# Altium schematic sheet PowerSwitch.SchDoc: POWER BLOCK
size A4; SheetNumber: 5; SheetTotal: 7; DOC_NO_SCH_DWG: #022024031504
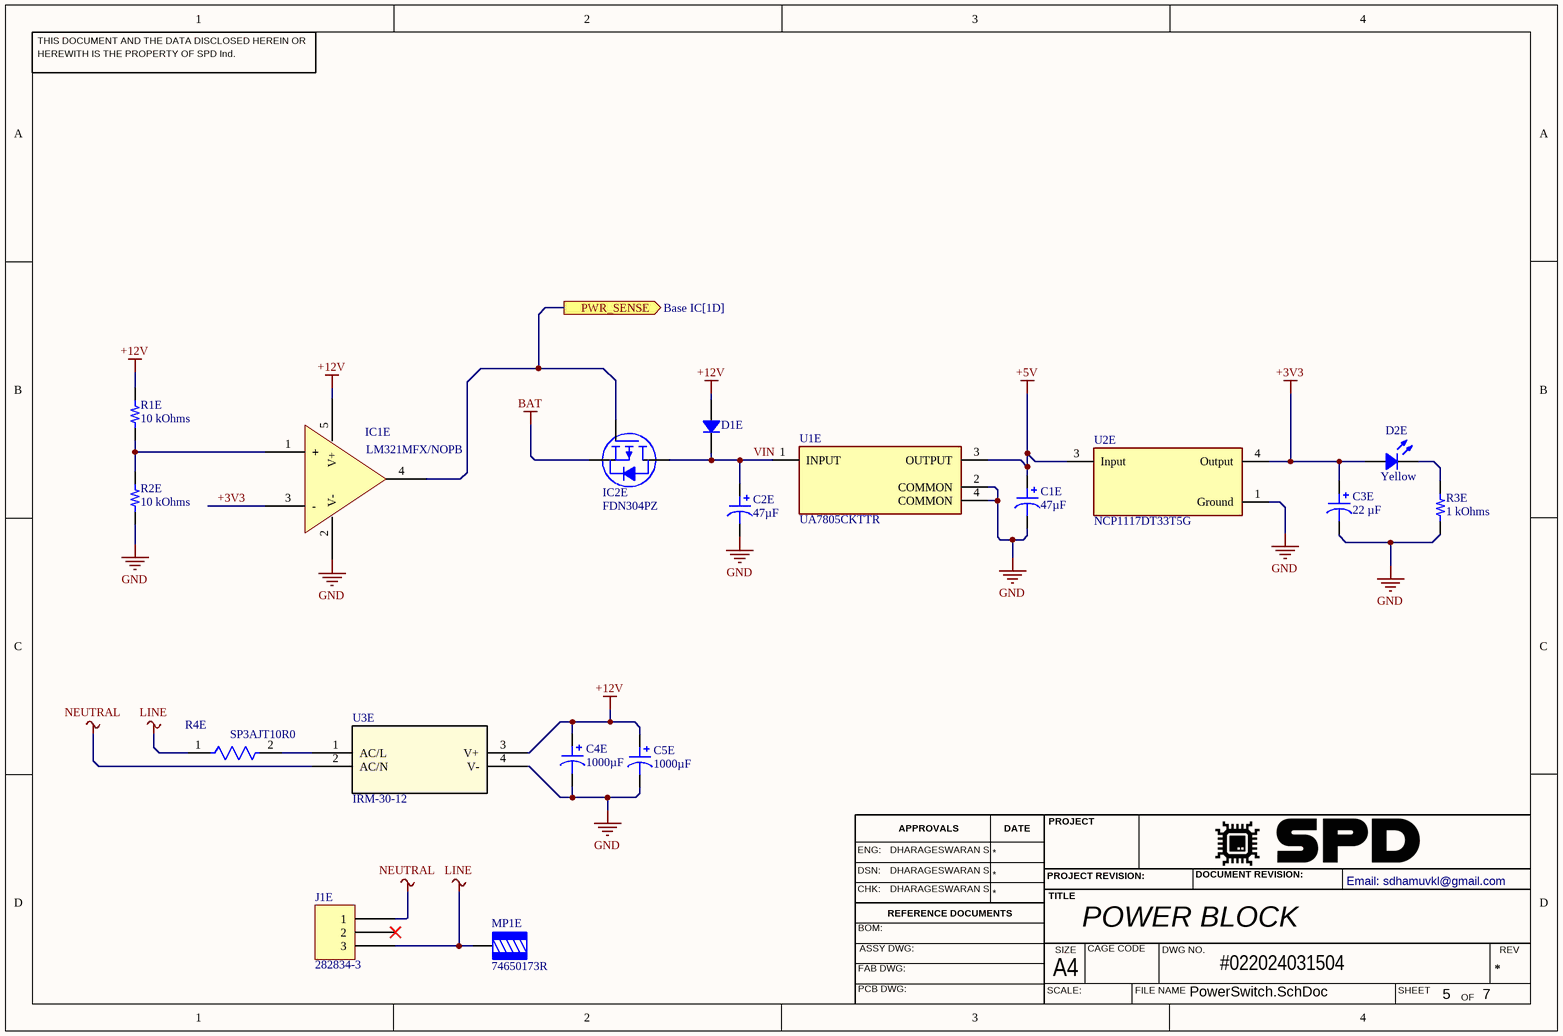
[diagram p0: PowerSwitch.SchDoc]

## Parts
C1E  47µF  [CAP ALSMD 6.6MM H5.4MM]
C2E  47µF  [CAP ALSMD 6.6MM H5.4MM]
C3E  22 µF  [CAP POL 2917_7343]
C4E  1000µF  [CAP TH ALUM ELEC D10.00mm S5.00mm H14.00mm]
C5E  1000µF  [CAP TH ALUM ELEC D10.00mm S5.00mm H14.00mm]
D1E  ES2A-13-F  [DO214AA SMB]  (value not drawn)
D2E  Yellow  [LED 0402_1005 YELLOW]
IC1E  LM321MFX/NOPB  [TI SOT-23-5 DBV]
IC2E  FDN304PZ  [ON SEMI SOT-23-3]
J1E  282834-3  [TE 282834-3]
MP1E  74650173R  [WURTH 74650173]
R1E  10 kOhms  [RES 0402_1005]
R2E  10 kOhms  [RES 0402_1005]
R3E  1 kOhms  [RES 0402_1005]
R4E  SP3AJT10R0  [FP-SP3A-MFG]
U1E  UA7805CKTTR  [FP-KTT0003A-MFG]
U2E  NCP1117DT33T5G  [FP-369C-MFG]
U3E  IRM-30-12  [IRM-30_MWU]

## Ports
PWR_SENSE (out, see Base IC[1D])

## Nets
+3V3: C3E.1 D2E.1 IC1E.3(-) U2E.4(Output)
+5V: C1E.1 U1E.3(OUTPUT) U2E.3(Input)
+12V: C4E.1 C5E.1 D1E.1 IC1E.5(V+) R1E.2 U3E.3(V+)
BAT: IC2E.2(S)
GND: C1E.2 C2E.2 C3E.2 C4E.2 C5E.2 IC1E.2(V-) R2E.1 R3E.1 U1E.2(COMMON) U1E.4(COMMON) U2E.1(Ground) U3E.4(V-)
LINE: J1E.3 MP1E.1 R4E.1
NEUTRAL: J1E.1 U3E.2(AC/N)
PWR_SENSE: IC1E.4(OUT) IC2E.1(G) ; port PWR_SENSE
VIN: C2E.1 D1E.2 IC2E.3(D) U1E.1(INPUT)
NetD2E_2: D2E.2 R3E.2
NetIC1E_1: IC1E.1(+) R1E.1 R2E.2
NetR4E_2: R4E.2 U3E.1(AC/L)

Not connected (* = marked no-connect by the designer): J1E 2*

## Notes on the sheet
- THIS DOCUMENT AND THE DATA DISCLOSED HEREIN OR
- HEREWITH IS THE PROPERTY OF SPD Ind.
- ENG:
- DHARAGESWARAN S
- APPROVALS
- DATE
- PROJECT
- DSN:
- CHK:
- REFERENCE DOCUMENTS
- PROJECT REVISION:
- TITLE
- DOCUMENT REVISION:
- Email: sdhamuvkl@gmail.com <https://github.com/DhamuVkl>
- BOM:
- FAB DWG:
- PCB DWG:
- ASSY DWG:
- SCALE:
- A4
- SIZE
- CAGE CODE
- FILE NAME
- DWG NO.
- SHEET
- REV
- OF

## Library data of the parts
C1E C2E = EEE-HA1C470P: CAP ALUM 47UF 20% 16V SMD; Manufacturer: Panasonic Electronic Components; id: 1065; Ripple Current @ Low Frequency: 70mA @ 120Hz; Surface Mount Land Size: 0.260" L x 0.260" W (6.60mm x 6.60mm); Polarization: Polar; Lifetime @ Temp.: 1000 Hrs @ 105°C; Ripple Current @ High Frequency: 119mA @ 10kHz; Part Number: EEE-HA1C470P; Value: 47µF; Height - Seated (Max): 0.213" (5.40mm); Supplier Part Number 1: PCE4189CT-ND; ComponentLink2Description: DigiKey Link; ComponentLink1URL: https://industrial.panasonic.com/cdbs/www-data/pdf/RDE0000/ABA0000C1151.pdf; PartId: 8737; Tolerance: ±20%; Supplier 1: DigiKey; Series: HA; LastUpdated: 2020-09-02T01:18:32.593; Part Status: Active; Capacitance: 47µF; Device Package: Radial, Can - SMD; Ratings: AEC-Q200; Voltage - Rated: 16V; Minimum Order: 1; Packaging: TapeAndReel; Applications: Automotive; Package / Case: Radial, Can - SMD; ComponentLink1Description: Datasheet; Price: 0.08; ComponentLink2URL: http://digikey.com/product-detail/en/panasonic-electronic-components/EEE-HA1C470P/PCE4189CT-ND/814262; Lifecycle Status: Active; Operating Temperature: -40°C ~ 105°C; Size / Dimension: 0.248" Dia (6.30mm); Mounting Type: Surface Mount
C3E = T491D226K010AT: CAP TANT 22UF 10% 10V 2917; Manufacturer: KEMET; Manufacturer Size Code: D; id: 3007; Type: Molded; Lifetime @ Temp.: 2000 Hrs @ 125°C; Esr (Equivalent Series Resistance): 1.6Ohm; Part Number: T491D226K010AT; Value: 22 µF; Height - Seated (Max): 0.122" (3.10mm); Supplier Part Number 1: 399-5599-1-ND; ComponentLink2Description: DigiKey Link; Features: General Purpose; ComponentLink1URL: https://api.kemet.com/component-edge/download/datasheet/T491D226K010AT.pdf; PartId: 3007; Tolerance: ±10%; Supplier 1: DigiKey; Series: T491; LastUpdated: 2023-01-02T20:46:27.020; Part Status: Active; Capacitance: 22 µF; Device Package: 2917 (7343 Metric); Voltage - Rated: 10 V; Minimum Order: 1; Packaging: TapeAndReel; Package / Case: 2917 (7343 Metric); ComponentLink1Description: Datasheet; Price: 0.31; ComponentLink2URL: https://www.digikey.com/en/products/detail/kemet/T491D226K010AT/2039625; Lifecycle Status: Active; Operating Temperature: -55°C ~ 125°C; Size / Dimension: 0.287" L x 0.169" W (7.30mm x 4.30mm); Mounting Type: Surface Mount
C4E C5E = 860020375017: CAP ALUM 1000UF 20% 16V RADIAL; Manufacturer: Würth Elektronik; id: 1938; Ripple Current @ Low Frequency: 540mA @ 120Hz; Polarization: Polar; Lifetime @ Temp.: 2000 Hrs @ 105°C; Ripple Current @ High Frequency: 745.2mA @ 100kHz; Part Number: 860020375017; Value: 1000µF; Height - Seated (Max): 0.551" (14.00mm); Supplier Part Number 1: 732-8804-1-ND; ComponentLink2Description: DigiKey Link; ComponentLink1URL: https://katalog.we-online.de/pbs/datasheet/860020375017.pdf; PartId: 11161; Tolerance: ±20%; Supplier 1: DigiKey; Series: WCAP-ATG5; LastUpdated: 2020-09-02T01:31:11.520; Part Status: Active; Capacitance: 1000µF; Device Package: Radial, Can; Voltage - Rated: 16V; Lead Spacing: 0.197" (5.00mm); Minimum Order: 1; Packaging: TapeAndBox; Applications: General Purpose; Package / Case: Radial, Can; ComponentLink1Description: Datasheet; Price: 0.24; ComponentLink2URL: http://digikey.com/product-detail/en/w-rth-elektronik/860020375017/732-8804-1-ND/5728749; Lifecycle Status: Active; Operating Temperature: -40°C ~ 105°C; Size / Dimension: 0.394" Dia (10.00mm); Mounting Type: Through Hole
D1E = ES2A-13-F: DIODE GEN PURP 50V 2A SMB; Manufacturer: Diodes Incorporated; id: 319; Reverse Recovery Time (Trr): 25 ns; Capacitance @ Vr, F: 25pF @ 4V, 1MHz; Speed: Fast Recovery =< 500ns, > 200mA (Io); Voltage - Forward (Vf) (Max) @ If: 920 mV @ 2 A; Diode Type: Standard; Current - Reverse Leakage @ Vr: 5 µA @ 50 V; Part Number: ES2A-13-F; Supplier Part Number 1: ES2A-FDICT-ND; Supplier Device Package: SMB; ComponentLink1Description: Datasheet; ComponentLink2URL: https://www.digikey.com/en/products/detail/diodes-incorporated/ES2A-13-F/815105; ComponentLink1URL: https://www.diodes.com/assets/Datasheets/ds14002.pdf; Supplier 1: DigiKey; Series: -; Part Status: Active; ComponentLink2Description: DigiKey Link; Current - Average Rectified (Io): 2A; Operating Temperature - Junction: -55°C ~ 150°C; Packaging: TapeAndReel; Minimum Order: 1; Voltage - DC Reverse (Vr) (Max): 50 V; Package / Case: DO-214AA, SMB; PartId: 319; Lifecycle Status: Active; LastUpdated: 2023-01-02T20:53:06.797; Mounting Type: Surface Mount; Price: 0.22
D2E = SM0402YC: LED YELLOW CLEAR 0402 SMD; Manufacturer: Bivar Inc.; id: 170; Lens Color: Colorless; Wavelength - Peak: 593nm; Lens Style: Rectangle with Flat Top; Viewing Angle: 130°; Lens Size: 0.50mm x 1.00mm; Configuration: 0402; Wavelength - Dominant: 592nm; Voltage - Forward (Vf) (Typ): 2V; Current - Test: 20mA; Millicandela Rating: 145mcd; Part Number: SM0402YC; Supplier Part Number 1: 492-2206-1-ND; Lens Transparency: Clear; Supplier Device Package: 0402; ComponentLink1Description: Datasheet; Color: Yellow; ComponentLink2URL: https://www.digikey.com/en/products/detail/bivar-inc/SM0402YC/6810862; ComponentLink1URL: https://www.bivar.com/Files/Datasheets/SM0402YC.pdf; Supplier 1: DigiKey; Series: -; Height (Max): 0.71mm; Part Status: Active; ComponentLink2Description: DigiKey Link; Device Package: 0402 (1005 Metric); Packaging: TapeAndReel; Minimum Order: 1; Package / Case: 0402 (1005 Metric); PartId: 170; Lifecycle Status: Active; LastUpdated: 2023-01-02T20:57:30.187; Value: Yellow; Size / Dimension: 1.00mm L x 0.50mm W; Mounting Type: Surface Mount; Price: 0.16
IC1E = LM321MFX/NOPB: IC OPAMP GP 1 CIRCUIT SOT23-5; Manufacturer: Texas Instruments; id: 11; Voltage - Input Offset: 2mV; Slew Rate: 0.4V/µs; Number Of Circuits: 1; Current - Input Bias: 45nA; Gain Bandwidth Product: 1MHz; Amplifier Type: General Purpose; Current - Supply: 660µA; Voltage - Supply, Single/Dual (±): 3V ~ 30V, ±1.5V ~ 15V; Current - Output / Channel: 40mA; Part Number: LM321MFX/NOPB; Supplier Part Number 1: LM321MFX/NOPBCT-ND; Supplier Device Package: SOT-23-5; ComponentLink1Description: Datasheet; ComponentLink2URL: http://digikey.com/product-detail/en/texas-instruments/LM321MFX-NOPB/LM321MFX-NOPBCT-ND/3440175; ComponentLink1URL: http://www.ti.com/general/docs/suppproductinfo.tsp?distId=10&gotoUrl=http%3A%2F%2Fwww.ti.com%2Flit%2Fgpn%2Flm321; Supplier 1: DigiKey; Series: -; Part Status: Active; ComponentLink2Description: DigiKey Link; Device Package: SC-74A, SOT-753; Packaging: TapeAndReel; Minimum Order: 1; Package / Case: SC-74A, SOT-753; PartId: 11; Lifecycle Status: Active; LastUpdated: 2020-03-30T15:10:58.873; Operating Temperature: -40°C ~ 85°C; Mounting Type: Surface Mount; Price: 0.23
IC2E = FDN304PZ: MOSFET P-CH 20V 2.4A SSOT-3; Manufacturer: ON Semiconductor; id: 80; FET Type: P-Channel; Drive Voltage (Max Rds On,  Min Rds On): 1.8V, 4.5V; Power Dissipation (Max): 500mW (Ta); Vgs (Max): ±8V; Input Capacitance (Ciss) (Max) @ Vds: 1310pF @ 10V; Gate Charge (Qg) (Max) @ Vgs: 20nC @ 4.5V; Current - Continuous Drain (Id) @ 25°C: 2.4A (Ta); Rds On (Max) @ Id, Vgs: 52mOhm @ 2.4A, 4.5V; Vgs(Th) (Max) @ Id: 1.5V @ 250µA; Part Number: FDN304PZ; Supplier Part Number 1: FDN304PZCT-ND; Supplier Device Package: SuperSOT-3; ComponentLink1Description: Datasheet; ComponentLink2URL: http://digikey.com/product-detail/en/on-semiconductor/FDN304PZ/FDN304PZCT-ND/1849909; ComponentLink1URL: https://www.onsemi.com/pub/Collateral/FDN304PZ-D.pdf; Supplier 1: DigiKey; Series: PowerTrench®; Part Status: Active; ComponentLink2Description: DigiKey Link; Packaging: TapeAndReel; Minimum Order: 1; Drain To Source Voltage (Vdss): 20V; Package / Case: TO-236-3, SC-59, SOT-23-3; Lifecycle Status: Active; LastUpdated: 2023-01-02T21:05:00.863; Technology: MOSFET (Metal Oxide); Operating Temperature: -55°C ~ 150°C (TJ); Mounting Type: Surface Mount; Price: 0.18
J1E = 282834-3: TERM BLK 3P SIDE ENT 2.54MM PCB; Manufacturer: TE Connectivity AMP Connectors; id: 2; Wire Gauge: 16-30 AWG; Voltage: 150V; Positions Per Level: 3; Number Of Levels: 1; Pitch: 0.100" (2.54mm); Mating Orientation: Horizontal with Board; Wire Termination: Screw - Rising Cage Clamp; Current: 10A; Part Number: 282834-3; Supplier Part Number 1: A98334-ND; ComponentLink1Description: Datasheet; Color: Green; ComponentLink2URL: http://digikey.com/product-detail/en/te-connectivity-amp-connectors/282834-3/A98334-ND/1153264; ComponentLink1URL: https://www.te.com/commerce/DocumentDelivery/DDEController?Action=srchrtrv&DocNm=282834&DocType=Customer+Drawing&DocLang=English; Supplier 1: DigiKey; Series: Buchanan; Part Status: Active; ComponentLink2Description: DigiKey Link; Packaging: Bulk; Minimum Order: 1; Lifecycle Status: Active; LastUpdated: 2020-01-15T04:15:50.317; Mounting Type: Through Hole; Price: 2.01
MP1E = 74650173R: TERM REDCUBE M3 4PIN PCB; Manufacturer: Würth Elektronik; id: 4; Current Rating (Amps): 50 A; Part Number: 74650173R; Supplier Part Number 1: 732-10885-1-ND; Termination: Solder; Screw Size: M3; ComponentLink1Description: Datasheet; ComponentLink2URL: https://www.digikey.com/en/products/detail/würth-elektronik/74650173R/6643981; Features: Screw not Included; ComponentLink1URL: https://katalog.we-online.de/em/datasheet/74650173R.pdf; Supplier 1: DigiKey; Series: REDCUBE WP-THRBU; Part Status: Active; ComponentLink2Description: DigiKey Link; Number Of Pins: 4; Packaging: TapeAndReel; Minimum Order: 1; Lifecycle Status: Active; LastUpdated: 2022-08-07T20:42:53.530; Terminal Type: Screw Terminal, Power Tap; Mounting Type: Through Hole; Price: 2.63
R1E R2E = AA0402FR-0710KL: RES SMD 10K OHM 1% 1/16W 0402; Manufacturer: Yageo; id: 10610; Temperature Coefficient: ±150ppm/°C; Power (Watts): 0.063W, 1/16W; Part Number: AA0402FR-0710KL; Height - Seated (Max): 0.015" (0.37mm); Supplier Part Number 1: 13-AA0402FR-0710KLCT-ND; Supplier Device Package: 0402; ComponentLink1Description: Datasheet; ComponentLink2URL: https://www.digikey.com/en/products/detail/yageo/AA0402FR-0710KL/5887729; Features: Anti-Sulfur, Automotive AEC-Q200, Moisture Resistant; ComponentLink1URL: https://www.yageo.com/upload/media/product/productsearch/datasheet/rchip/PYu-AA_51_RoHS_L_3.pdf; Composition: Thick Film; Tolerance: ±1%; Supplier 1: DigiKey; Series: AA; Part Status: Active; ComponentLink2Description: DigiKey Link; Device Package: 0402 (1005 Metric); Packaging: TapeAndReel; Ratings: AEC-Q200; Minimum Order: 1; Package / Case: 0402 (1005 Metric); PartId: 59190; Lifecycle Status: Active; LastUpdated: 2023-01-02T20:20:10.303; Operating Temperature: -55°C ~ 155°C; Number Of Terminations: 2; Value: 10 kOhms; Size / Dimension: 0.039" L x 0.020" W (1.00mm x 0.50mm); Price: 0.01; Resistance: 10 kOhms
R3E = AA0402FR-071KL: RES SMD 1K OHM 1% 1/16W 0402; Manufacturer: Yageo; id: 10598; Temperature Coefficient: ±150ppm/°C; Power (Watts): 0.063W, 1/16W; Part Number: AA0402FR-071KL; Height - Seated (Max): 0.015" (0.37mm); Supplier Part Number 1: 13-AA0402FR-071KLCT-ND; Supplier Device Package: 0402; ComponentLink1Description: Datasheet; ComponentLink2URL: https://www.digikey.com/en/products/detail/yageo/AA0402FR-071KL/5887878; Features: Anti-Sulfur, Automotive AEC-Q200, Moisture Resistant; ComponentLink1URL: https://www.yageo.com/upload/media/product/productsearch/datasheet/rchip/PYu-AA_51_RoHS_L_3.pdf; Composition: Thick Film; Tolerance: ±1%; Supplier 1: DigiKey; Series: AA; Part Status: Active; ComponentLink2Description: DigiKey Link; Device Package: 0402 (1005 Metric); Packaging: TapeAndReel; Ratings: AEC-Q200; Minimum Order: 1; Package / Case: 0402 (1005 Metric); PartId: 59178; Lifecycle Status: Active; LastUpdated: 2023-01-02T20:20:10.210; Operating Temperature: -55°C ~ 155°C; Number Of Terminations: 2; Value: 1 kOhms; Size / Dimension: 0.039" L x 0.020" W (1.00mm x 0.50mm); Price: 0.01; Resistance: 1 kOhms
R4E = CMP-26528-000004-1: RES 10 OHM 5% 4W AXIAL; Resistance: 10R; Temperature Coefficient: 20ppm/°C; Power Rating: 4W; Series: SP; Mount: Through Hole; Diameter: 5.5mm; RoHS Compliant: Yes; Length: 12.7mm; Max Operating Temperature: 350°C; Max Power Dissipation: 4W; Number of Terminations: 2; Resistor Type: Wirewound; Min Operating Temperature: -55°C; Case/Package: Axial; Tolerance: 5%; Package Quantity: 1; Packaging: Cut Tape
U1E = CMP-1685-00014-2: IC REG LIN 5V 1.5A DDPAK/TO263-3; Output Type: Fixed; Quiescent Current: 8mA; Dropout Voltage: 2V; Max Input Voltage: 25V; Number of Regulators: 1; Max Output Voltage: 5.2V; Polarity: Positive; Min Output Voltage: 4.8V; Power Supply Rejection Ratio (PSRR): 78dB; Min Input Voltage: 7V; Power Rating: 15W; Number of Pins: 3; Output Voltage: 5V; Max Output Current: 1.5A; Nominal Output Voltage: 5V; Case/Package: TO-263; Width: 9.65mm; REACH SVHC: No SVHC; Max Operating Temperature: 125°C; Output Current: 1.5A; Weight: 0.050897oz; Contact Plating: Tin; Packaging: Tape and Reel; Mount: Surface Mount; Radiation Hardening: No; Lead Free: Lead Free; Min Operating Temperature: 0°C; Length: 10.67mm; Package Quantity: 1; Number of Outputs: 1; Height: 4.83mm
U2E = CMP-07128-000023-2: IC REG LINEAR 3.3V 1A DPAK; Polarity: Positive; Input Bias Current: 6mA; Quiescent Current: 10mA; Output Type: Fixed; Number of Outputs: 1; Output Voltage Accuracy: 1%; Max Input Voltage: 20V; Dropout Voltage: 1.07V; Reference Voltage: 1.27V; Lead Free: Lead Free; Width: 6.22mm; Min Current Limit: 1A; Case/Package: DPAK; Output Voltage: 3.3V; Halogen Free: Halogen Free; Radiation Hardening: No; Min Operating Temperature: 0°C; Nominal Output Voltage: 3.3V; Output Current: 1A; Package Quantity: 1; Max Operating Temperature: 125°C; Max Output Current: 1A; Number of Regulators: 1; REACH SVHC: No SVHC; Packaging: Tape and Reel; Number of Pins: 3; Height: 2.38mm; Length: 6.73mm; Mount: Surface Mount; Contact Plating: Tin; Accuracy: 1%
U3E = IRM-30-12: No Description Available; Mfr_Name: Mean Well; RefDes: RefDes; Type: Type; Supplier 1: Future Electronics; Supplier Part Number 1: 9051654